# EAGLE design AC_soil_sensor_v1.0 (EAGLE 9.6.2)
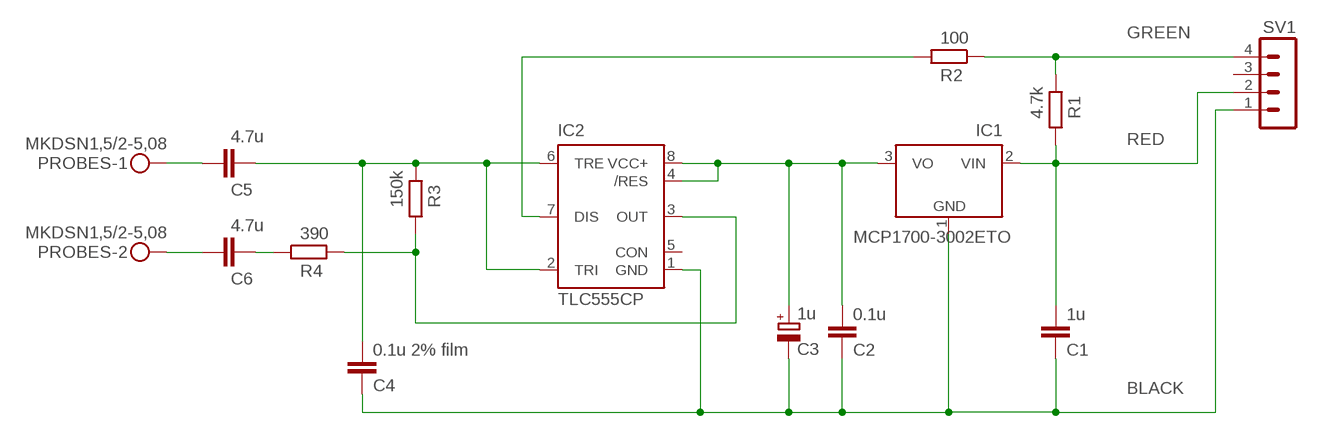
[diagram p0: schematic, sheet 1]

## Parts
C1  1u  C-EU025-025X050  [C025-025X050]
C2  0.1u  C-EU050-025X075  [C050-025X075]
C3  1u  CPOL-EUE2-5  [E2-5]
C4  0.1u 2% film  C-EU050-025X075  [C050-025X075]
C5  4.7u  C-EU025-025X050  [C025-025X050]
C6  4.7u  C-EU025-025X050  [C025-025X050]
IC1  MCP1700-3002ETO  [TO92]
IC2  TLC555CP  [DIL-08]
PROBES  MKDSN1,5/2-5,08  [MKDSN1,5/2-5,08]
R1  4.7k  R-EU_0207/10  [0207/10]
R2  100  R-EU_0207/10  [0207/10]
R3  150k  R-EU_0207/10  [0207/10]
R4  390  R-EU_0207/10  [0207/10]
SV1  MA04-1  [MA04-1]

## Nets
BLACK: C1.1 C2.2 C3.- C4.2 IC1.1(GND) IC2.1(GND) SV1.1
GREEN: R1.2 R2.1 SV1.4
N$1: C4.1 C5.2 IC2.2(TRI) IC2.6(TRE) R3.2
N$3: C6.2 R4.1
N$4: C5.1 PROBES.1
N$5: C2.1 C3.+ IC1.3(VO) IC2.4(/RES) IC2.8(VCC+)
N$6: IC2.3(OUT) R3.1 R4.2
N$7: IC2.7(DIS) R2.2
N$8: C6.1 PROBES.2
RED: C1.2 IC1.2(VIN) R1.1 SV1.2
Unconnected: IC2.5(CON) SV1.3

## Library data of the parts
C1 C2 C4-C6 = rcl:C-EU: CAPACITOR, European symbol; SPICEPREFIX: C
C3 = rcl:CPOL-EU: POLARIZED CAPACITOR, European symbol; SPICEPREFIX: C
IC1 = custom_library:MCP1700: Low Quiescent Current LDO Voltage Regulator Source: Data sheet <https://ww1.microchip.com/downloads/en/DeviceDoc/MCP1700-Low-Quiescent-Current-LDO-20001826E.pdf>; MF: MICROCHIP
IC2 = custom_library:TLC555: LinCMOS timer; MF: TEXAS INSTRUMENTS
PROBES = con-phoenix-508:MKDSN1,5/2-5,08: MKDSN 1,5/ 2-5,08 Printklemme Nennstrom: 13,5 A Nennspannung: 250 V Rastermaß: 5,08 mm Polzahl: 2 Anschlussart: Schraubanschluss Montage: Löten Anschlussrichtung Leiter/Platine: 0 ° Artikelnummer: 1729128 Source: http://eshop.phoenixcontact.com .. 1729128.pdf
R1-R4 = rcl:R-EU_: RESISTOR, European symbol; SPICEPREFIX: R
SV1 = con-lstb:MA04-1: PIN HEADER; OC_FARNELL: unknown; OC_NEWARK: unknown; SPICEPREFIX: S

## Module MCP1700-3002ETO
Ports: 

### Library data of the parts

## Board
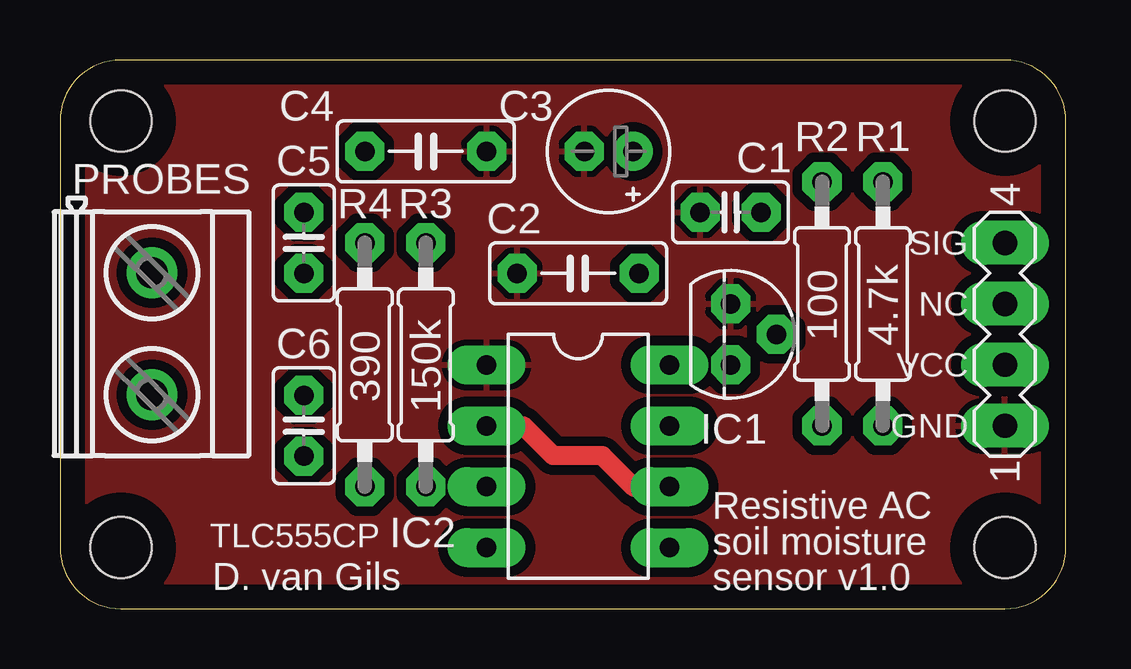
[diagram p1: board, top side]
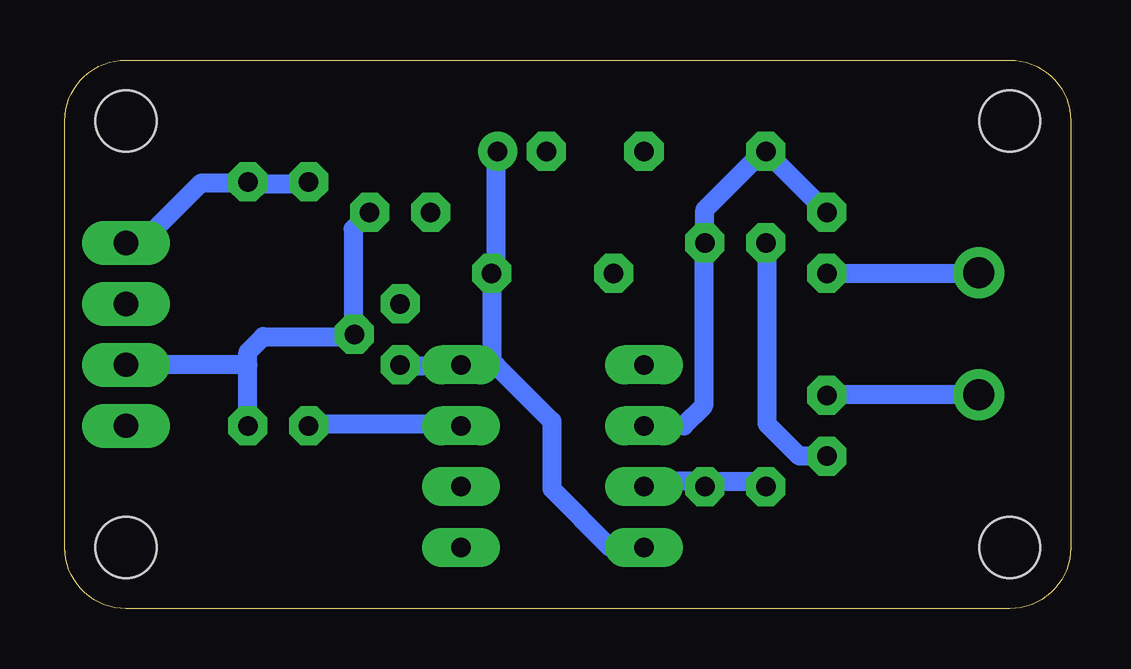
[diagram p2: board, bottom side, seen from below]

Size 41.91 x 22.86 mm. Coordinates in mm from the lower left corner, seen from the top.
Outline: 0,20.32 0,2.54 arc90 2.54,0 39.37,0 arc90 41.91,2.54 41.91,20.32 arc90 39.37,22.86 2.54,22.86 arc90 0,20.32
Copper layers (1*16): Top 0.035mm / dielectric 1.5mm / Bottom 0.035mm
Design rules "default *": minimum track width 0.8mm, minimum drill 0.8mm, track to track 16mil, track to pad 16mil, pad to pad 16mil, via to via 16mil, smd to smd 8mil, copper to edge 40mil, drill to drill 6mil, minimum pad ring 16mil, minimum via ring 16mil, stop-mask expansion 4mil, vias tented up to drill 0mil, thermal gap 10mil
Holes 2.54 mm at 39.37,20.32 39.37,2.54 2.54,20.32 2.54,2.54

### Footprints (pad centres in the part's own frame; a part is rotated, then mirrored left to right if it is on the bottom)
C025-025X050 = drill 0.813 octagon: 1 -1.27,0; 2 1.27,0
C050-025X075 = drill 0.813 octagon: 1 -2.54,0; 2 2.54,0
E2-5 = drill 0.813 pad 1.27: + -1.016,0 | drill 0.813 pad 1.27 octagon: - 1.016,0
TO92 = drill 0.813 pad 1.27 octagon: 1 -1.27,0; 2 0,1.905; 3 1.27,0
DIL-08 = drill 0.813 long: 1 -3.81,-3.81; 2 -1.27,-3.81; 3 1.27,-3.81; 4 3.81,-3.81; 5 3.81,3.81; 6 1.27,3.81; 7 -1.27,3.81; 8 -3.81,3.81
MKDSN1,5/2-5,08 = drill 1.3 pad 2: 1 -2.561,0.025; 2 2.519,0.025
0207/10 = drill 0.813 octagon: 1 -5.08,0; 2 5.08,0
MA04-1 = drill 1.016 long: 1 -3.81,0; 2 -1.27,0; 3 1.27,0; 4 3.81,0

### Placement (x,y rotation side)
C1  27.94,16.51 0 top
C2  21.59,13.97 180 top
C3  22.86,19.05 180 top
C4  15.24,19.05 0 top
C5  10.16,15.24 90 top
C6  10.16,7.62 270 top
IC1  27.94,11.43 270 top
IC2  21.59,6.35 270 top
PROBES  3.81,11.43 270 top
R1  34.29,12.7 90 top
R2  31.75,12.7 270 top
R3  15.24,10.16 90 top
R4  12.7,10.16 270 top
SV1  39.37,11.43 90 top

### Tracks (layer width: path | path; a pad name or v marks a point on that pad's centre or on a via)
BLACK
  pour Top: -1.27,24.13 -1.27,-1.27 43.18,-1.27 43.18,24.13
GREEN
  Bottom 0.8: R2.1 31.82,17.71 34.22,17.71 R1.2 34.33,17.74 36.22,17.74 38.67,15.3 39.28,15.3 SV1.4
N$1
  Top 0.8: IC2.6 25.36,5.04 23.93,5.04 22.6,6.38 20.55,6.38 19.3,7.62 IC2.2
  Bottom 0.8: C5.2 C4.1 12.82,19.05 15.24,16.63 R3.2 15.3,15.18 15.3,8.44 16.12,7.62 IC2.2
N$3
  Bottom 0.8: C6.2 11.3,6.35 12.66,7.71 12.66,15.18 R4.1
N$4
  Bottom 0.8: PROBES.1 3.86,13.97 C5.1
N$5
  Bottom 0.8: IC2.4 19.18,2.54 21.62,4.98 21.62,7.81 23.93,10.12 25.14,10.12 IC2.8 | C3.+ 23.93,18.57 23.93,14.35 C2.1 24.13,10.16 IC2.8 | IC2.8 25.75,10.12 27.55,10.12 IC1.3
N$6
  Bottom 0.8: R4.2 13.14,5.3 14.95,5.3 R3.1 15.55,5.3 17.3,5.3 IC2.3
N$7
  Bottom 0.8: IC2.7 25.75,7.71 31.68,7.71 R2.2
N$8
  Bottom 0.8: C6.1 9.59,8.92 4.16,8.92 PROBES.2
RED
  Bottom 0.8: C1.2 29.9,15.82 29.9,11.52 IC1.2 30.16,11.33 33.65,11.33 34.29,10.69 R1.1 34.29,10.16 SV1.2

### Text on the board
tNames: SIG | NC | VCC | GND | TLC555CP | D. van Gils | Resistive AC / soil moisture / sensor v1.0